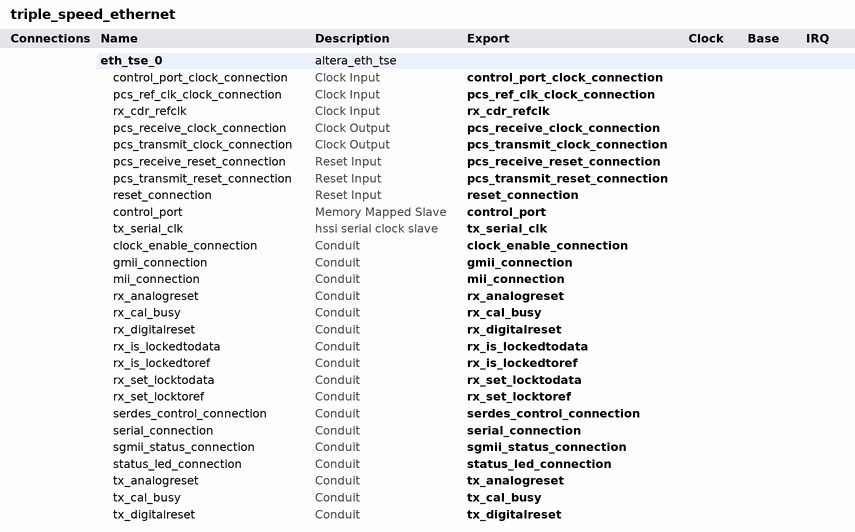
[diagram p0: system contents]
# Platform Designer (Qsys) system triple_speed_ethernet, Arria 10 10AS066H2F34I1SG
# Parameters at their usual value, and those the tool derives, are not listed.
package require -exact qsys 17.1
create_system triple_speed_ethernet
set_project_property DEVICE_FAMILY {Arria 10}
set_project_property DEVICE 10AS066H2F34I1SG

add_instance eth_tse_0 altera_eth_tse 17.1
set_instance_property eth_tse_0 AUTO_EXPORT true
set_instance_parameter_value eth_tse_0 XCVR_RCFG_JTAG_ENABLE 0
set_instance_parameter_value eth_tse_0 XCVR_SET_CAPABILITY_REG_ENABLE 0
set_instance_parameter_value eth_tse_0 XCVR_SET_CSR_SOFT_LOGIC_ENABLE 0
set_instance_parameter_value eth_tse_0 XCVR_SET_PRBS_SOFT_LOGIC_ENABLE 0
set_instance_parameter_value eth_tse_0 XCVR_SET_USER_IDENTIFIER 0
set_instance_parameter_value eth_tse_0 core_variation PCS_ONLY
set_instance_parameter_value eth_tse_0 enable_hd_logic true
set_instance_parameter_value eth_tse_0 enable_mac_flow_ctrl false
set_instance_parameter_value eth_tse_0 enable_magic_detect true
set_instance_parameter_value eth_tse_0 enable_sgmii true
set_instance_parameter_value eth_tse_0 enable_shift16 true
set_instance_parameter_value eth_tse_0 ifGMII MII_GMII
set_instance_parameter_value eth_tse_0 ing_addr 11
set_instance_parameter_value eth_tse_0 mdio_clk_div 40
set_instance_parameter_value eth_tse_0 stat_cnt_ena true
set_instance_parameter_value eth_tse_0 transceiver_type GXB
set_instance_parameter_value eth_tse_0 useMDIO false

# exported interfaces
add_interface clock_enable_connection conduit end
set_interface_property clock_enable_connection EXPORT_OF eth_tse_0.clock_enable_connection
add_interface control_port avalon slave
set_interface_property control_port EXPORT_OF eth_tse_0.control_port
add_interface control_port_clock_connection clock sink
set_interface_property control_port_clock_connection EXPORT_OF eth_tse_0.control_port_clock_connection
add_interface gmii_connection conduit end
set_interface_property gmii_connection EXPORT_OF eth_tse_0.gmii_connection
add_interface mii_connection conduit end
set_interface_property mii_connection EXPORT_OF eth_tse_0.mii_connection
add_interface pcs_receive_clock_connection clock source
set_interface_property pcs_receive_clock_connection EXPORT_OF eth_tse_0.pcs_receive_clock_connection
add_interface pcs_receive_reset_connection reset sink
set_interface_property pcs_receive_reset_connection EXPORT_OF eth_tse_0.pcs_receive_reset_connection
add_interface pcs_ref_clk_clock_connection clock sink
set_interface_property pcs_ref_clk_clock_connection EXPORT_OF eth_tse_0.pcs_ref_clk_clock_connection
add_interface pcs_transmit_clock_connection clock source
set_interface_property pcs_transmit_clock_connection EXPORT_OF eth_tse_0.pcs_transmit_clock_connection
add_interface pcs_transmit_reset_connection reset sink
set_interface_property pcs_transmit_reset_connection EXPORT_OF eth_tse_0.pcs_transmit_reset_connection
add_interface reset_connection reset sink
set_interface_property reset_connection EXPORT_OF eth_tse_0.reset_connection
add_interface rx_analogreset conduit end
set_interface_property rx_analogreset EXPORT_OF eth_tse_0.rx_analogreset
add_interface rx_cal_busy conduit end
set_interface_property rx_cal_busy EXPORT_OF eth_tse_0.rx_cal_busy
add_interface rx_cdr_refclk clock sink
set_interface_property rx_cdr_refclk EXPORT_OF eth_tse_0.rx_cdr_refclk
add_interface rx_digitalreset conduit end
set_interface_property rx_digitalreset EXPORT_OF eth_tse_0.rx_digitalreset
add_interface rx_is_lockedtodata conduit end
set_interface_property rx_is_lockedtodata EXPORT_OF eth_tse_0.rx_is_lockedtodata
add_interface rx_is_lockedtoref conduit end
set_interface_property rx_is_lockedtoref EXPORT_OF eth_tse_0.rx_is_lockedtoref
add_interface rx_set_locktodata conduit end
set_interface_property rx_set_locktodata EXPORT_OF eth_tse_0.rx_set_locktodata
add_interface rx_set_locktoref conduit end
set_interface_property rx_set_locktoref EXPORT_OF eth_tse_0.rx_set_locktoref
add_interface serdes_control_connection conduit end
set_interface_property serdes_control_connection EXPORT_OF eth_tse_0.serdes_control_connection
add_interface serial_connection conduit end
set_interface_property serial_connection EXPORT_OF eth_tse_0.serial_connection
add_interface sgmii_status_connection conduit end
set_interface_property sgmii_status_connection EXPORT_OF eth_tse_0.sgmii_status_connection
add_interface status_led_connection conduit end
set_interface_property status_led_connection EXPORT_OF eth_tse_0.status_led_connection
add_interface tx_analogreset conduit end
set_interface_property tx_analogreset EXPORT_OF eth_tse_0.tx_analogreset
add_interface tx_cal_busy conduit end
set_interface_property tx_cal_busy EXPORT_OF eth_tse_0.tx_cal_busy
add_interface tx_digitalreset conduit end
set_interface_property tx_digitalreset EXPORT_OF eth_tse_0.tx_digitalreset
add_interface tx_serial_clk hssi_serial_clock end
set_interface_property tx_serial_clk EXPORT_OF eth_tse_0.tx_serial_clk

set_interconnect_requirement {$system} qsys_mm.clockCrossingAdapter HANDSHAKE
set_interconnect_requirement {$system} qsys_mm.enableEccProtection FALSE
set_interconnect_requirement {$system} qsys_mm.insertDefaultSlave FALSE
set_interconnect_requirement {$system} qsys_mm.maxAdditionalLatency 1

save_system triple_speed_ethernet.qsys
